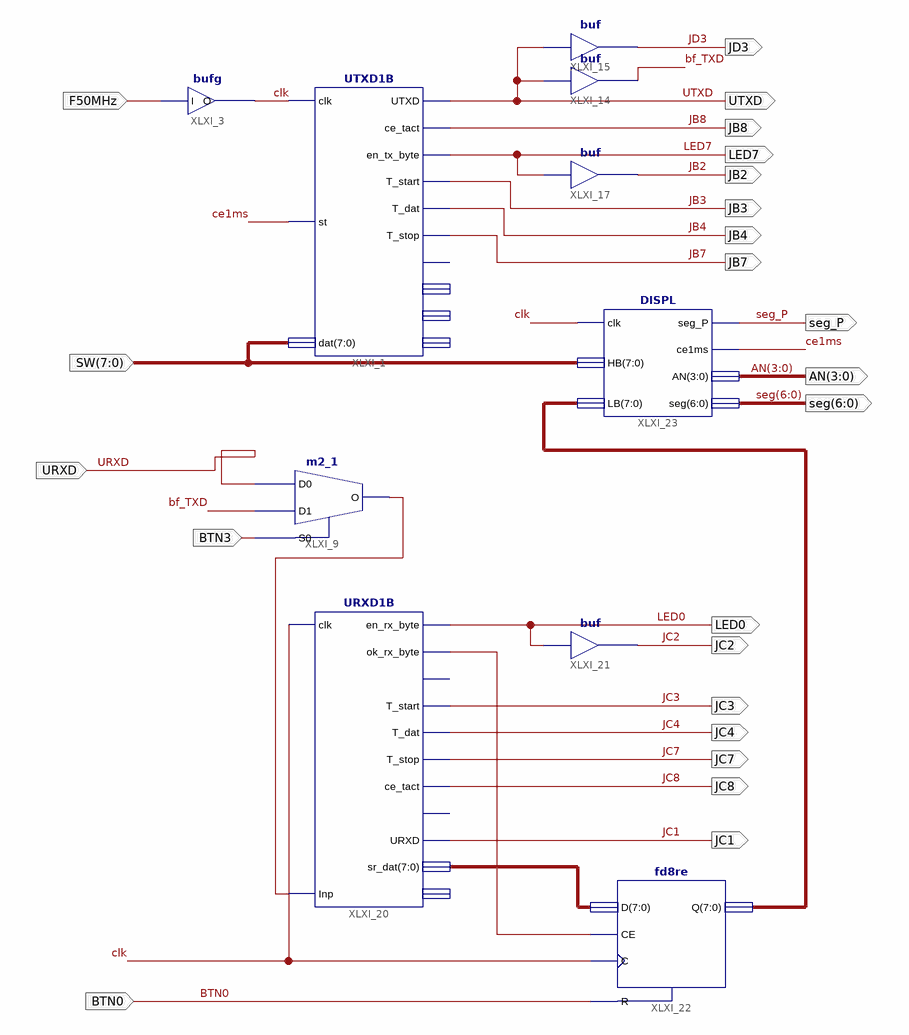
[diagram p0: schematic sheet 1]
// Xilinx ISE schematic Sch_Lab404_1B.sch (spartan3e) as structural Verilog: 10 symbols, 23 ports
module Sch_Lab404_1B (
  input  [7:0] SW,
  input  BTN3,
  input  F50MHz,
  input  BTN0,
  input  URXD,
  output LED7,
  output JD3,
  output JB2,
  output JB8,
  output UTXD,
  output JB3,
  output JB4,
  output JB7,
  output LED0,
  output JC2,
  output JC4,
  output JC3,
  output JC7,
  output JC8,
  output JC1,
  output seg_P,
  output [3:0] AN,
  output [6:0] seg
);

  wire bf_TXD, ce1ms, clk, XLXN_83, XLXN_93;
  wire [7:0] XLXN_92, XLXN_98;

  UTXD1B XLXI_1 (
    .clk(clk), .st(ce1ms), .dat(SW), .UTXD(UTXD), .ce_tact(JB8), .en_tx_byte(LED7), .T_start(JB3),
    .T_dat(JB4), .T_stop(JB7));  // open: ce_stop, cb_bit, cb_tact, sr_dat
  m2_1 XLXI_9 (.D0(URXD), .D1(bf_TXD), .S0(BTN3), .O(XLXN_83));
  bufg XLXI_3 (.I(F50MHz), .O(clk));
  buf XLXI_14 (bf_TXD, UTXD);
  buf XLXI_15 (JD3, UTXD);
  buf XLXI_17 (JB2, LED7);
  URXD1B XLXI_20 (
    .clk(clk), .Inp(XLXN_83), .en_rx_byte(LED0), .ok_rx_byte(XLXN_93), .T_start(JC3), .T_dat(JC4),
    .T_stop(JC7), .ce_tact(JC8), .URXD(JC1), .sr_dat(XLXN_92));  // open: start, ce_bit, cb_bit
  buf XLXI_21 (JC2, LED0);
  fd8re XLXI_22 (.C(clk), .CE(XLXN_93), .D(XLXN_92), .R(BTN0), .Q(XLXN_98));
  DISPL XLXI_23 (.clk(clk), .HB(SW), .LB(XLXN_98), .seg_P(seg_P), .ce1ms(ce1ms), .AN(AN), .seg(seg));
endmodule
